# Altium schematic sheet TC264Power.SchDoc
size A1; SheetNumber: 1; SheetTotal: 1
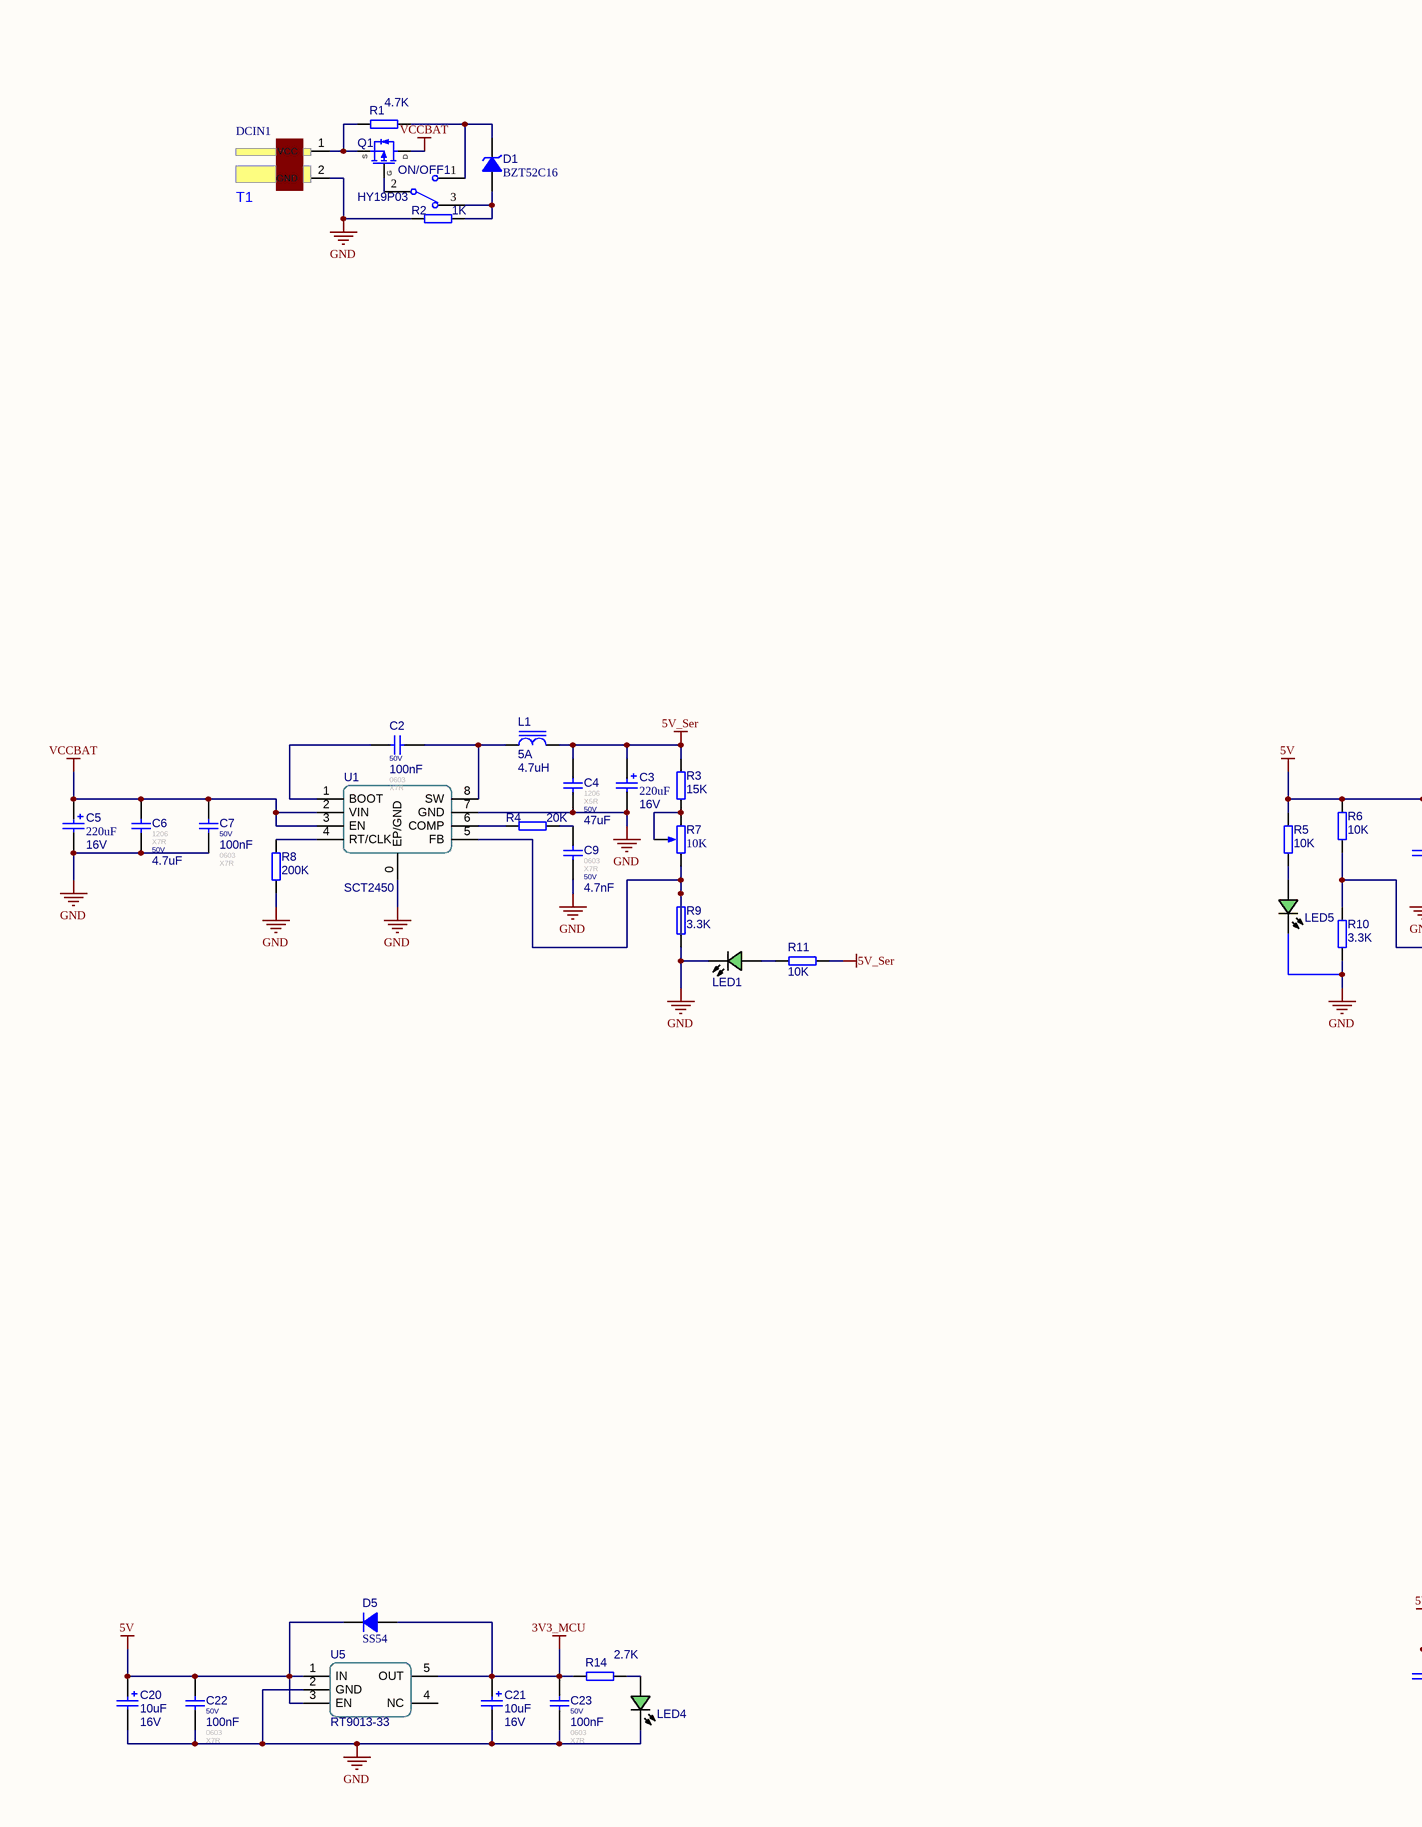
[diagram p0: TC264Power.SchDoc, left]
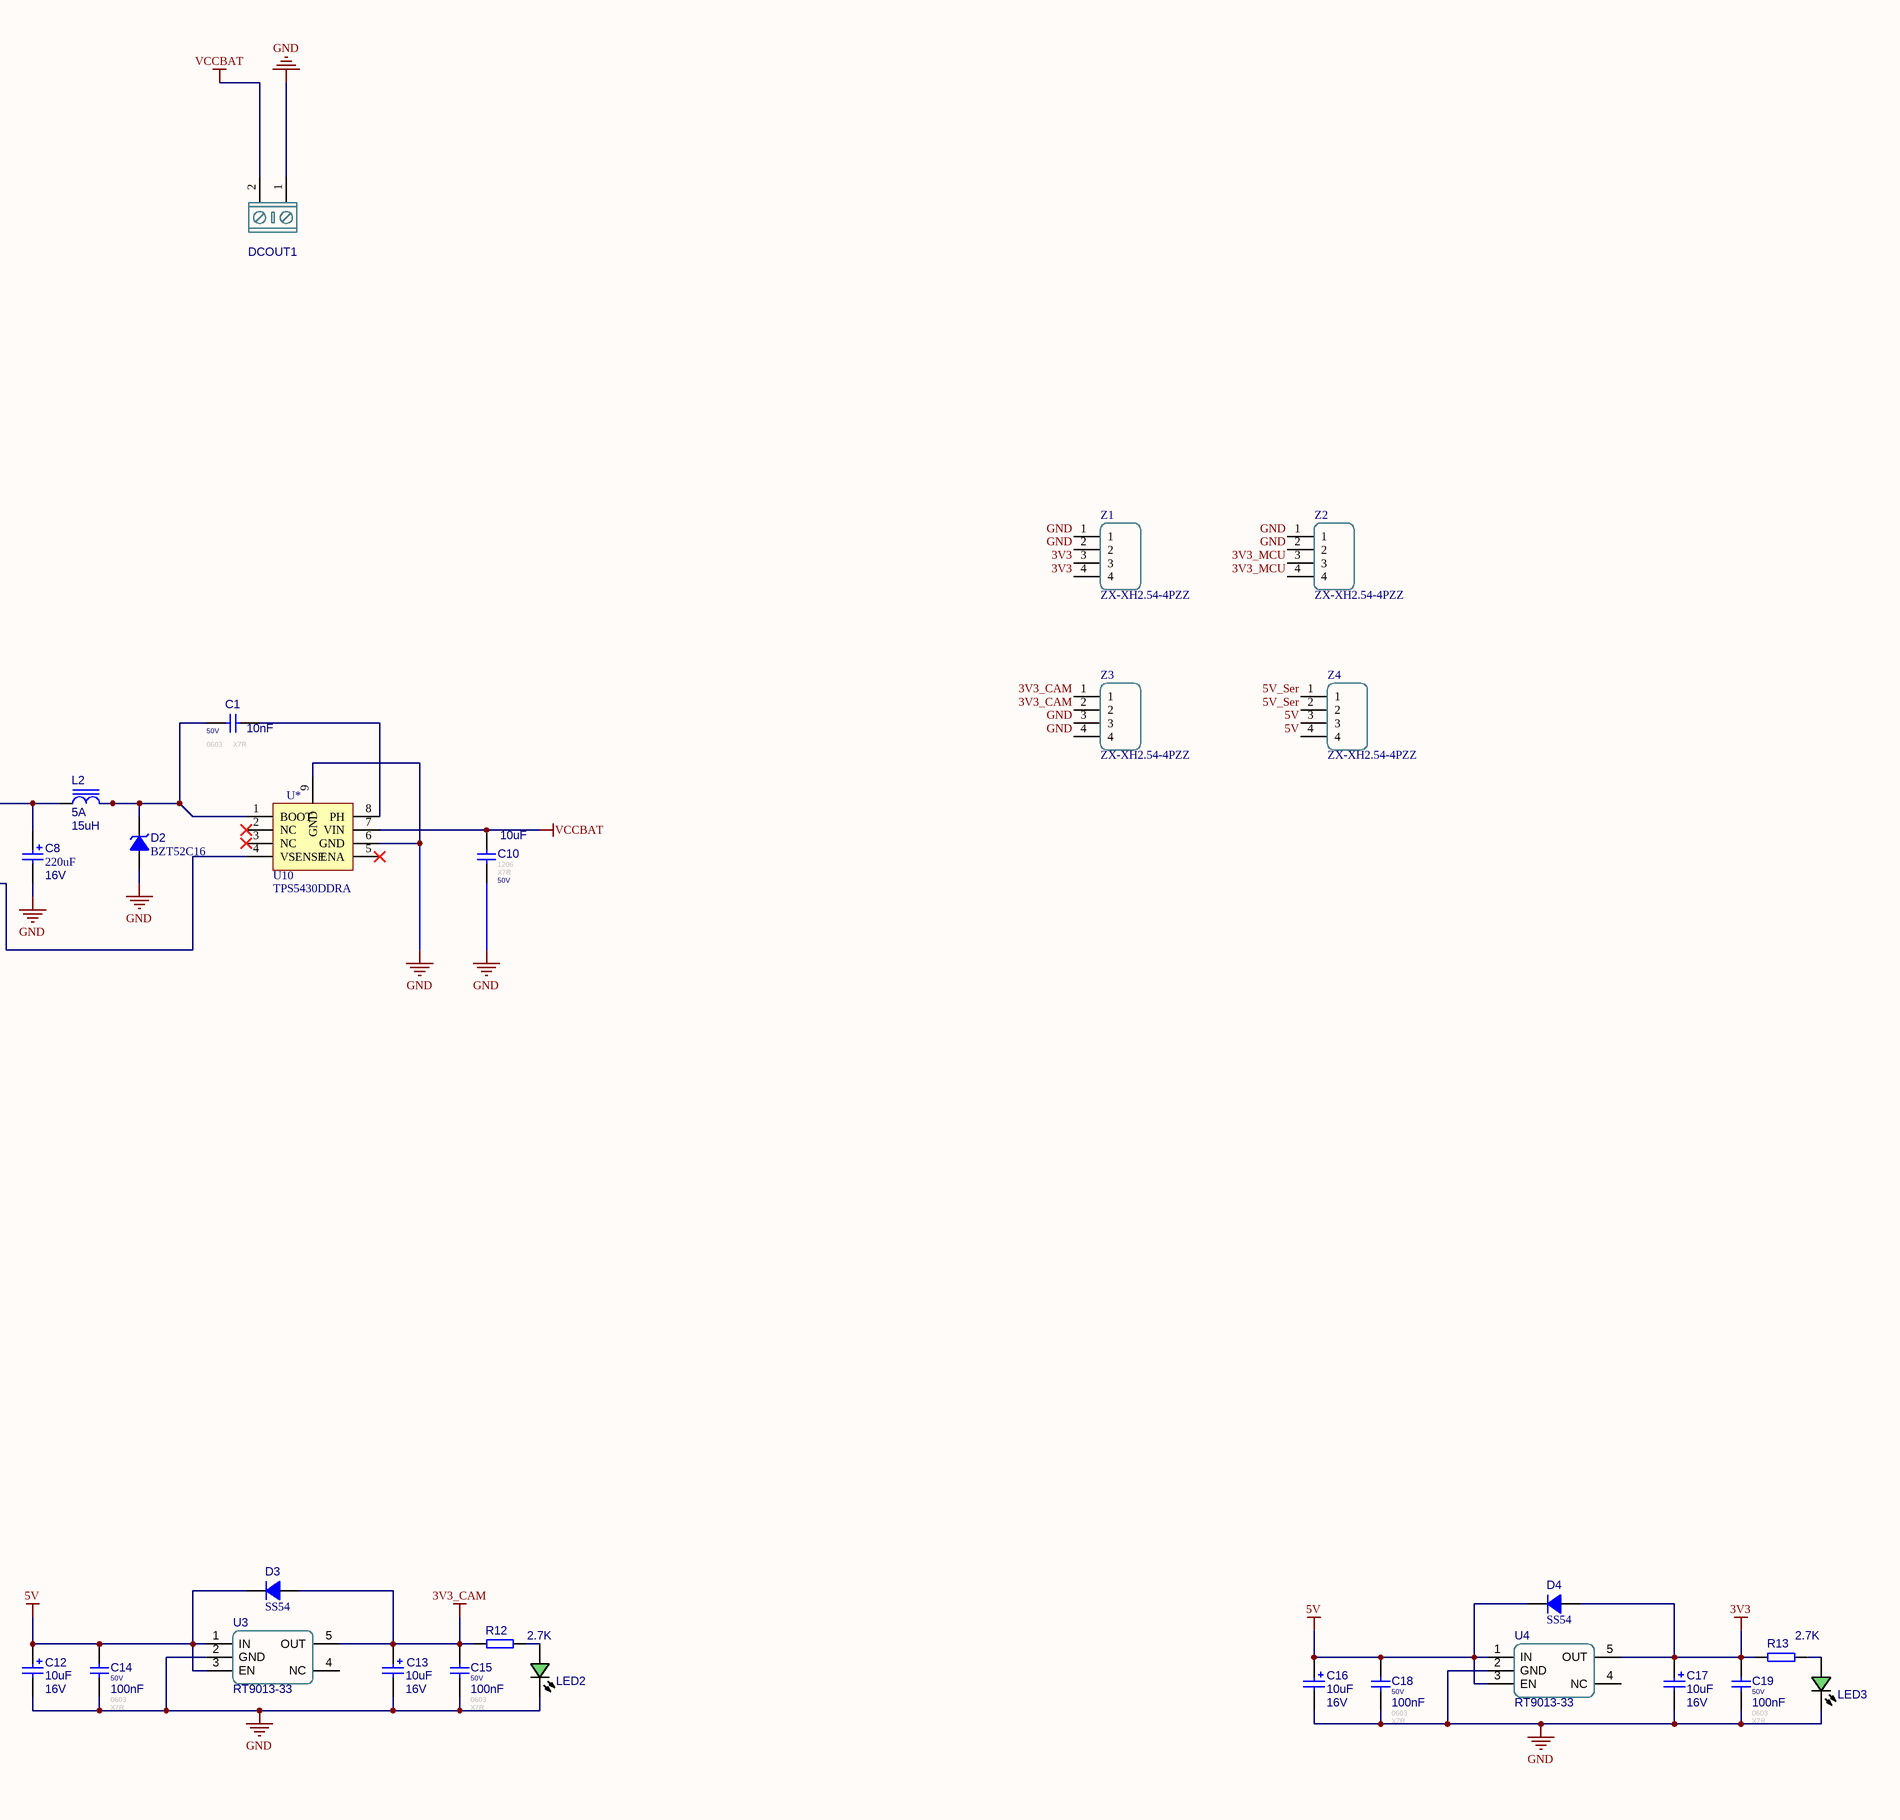
[diagram p1: TC264Power.SchDoc, right]

## Parts
C1  value 10nF  Voltage: 50V  Footprint: 0603  Type: X7R  [CAPC3216[1206]S]  (hidden comment: 10nF ±10% 50V)
C2  value 100nF  Voltage: 50V  Footprint: 0603  Type: X7R  [CAPC3216[1206]S]  (hidden comment: 100nF ±10% 50V)
C3  value 220uF  Voltage: 16V  [CAPS6.3]  (hidden comment: 220uF 16V)
C4  value 47uF  Footprint: 1206  Type: X5R  Voltage: 50V  [CAPC3216[1206]S]  (hidden comment: 47uF ±10% 50V)
C5  value 220uF  Voltage: 16V  [CAPS6.3]  (hidden comment: 220uF 16V)
C6  value 4.7uF  Footprint: 1206  Type: X7R  Voltage: 50V  [CAPC3216[1206]S]  (hidden comment: 4.7uF ±10% 50V)
C7  value 100nF  Voltage: 50V  Footprint: 0603  Type: X7R  [CAPC3216[1206]S]  (hidden comment: 100nF ±10% 50V)
C8  value 220uF  Voltage: 16V  [CAPS6.3]  (hidden comment: 220uF 16V)
C9  value 4.7nF  Footprint: 0603  Type: X7R  Voltage: 50V  [CAPC3216[1206]S]  (hidden comment: 4.7nF ±10% 50V)
C10  value 10uF  Footprint: 1206  Type: X7R  Voltage: 50V  [CAPC3216[1206]S]  (hidden comment: 10uF ±10% 50V)
C12  value 10uF  Voltage: 16V  [CAPT3216]  (hidden comment: 10uF 16V)
C13  value 10uF  Voltage: 16V  [CAPT3216]  (hidden comment: 10uF 16V)
C14  value 100nF  Voltage: 50V  Footprint: 0603  Type: X7R  [CAPC3216[1206]S]  (hidden comment: 100nF ±10% 50V)
C15  value 100nF  Voltage: 50V  Footprint: 0603  Type: X7R  [CAPC3216[1206]S]  (hidden comment: 100nF ±10% 50V)
C16  value 10uF  Voltage: 16V  [CAPT3216]  (hidden comment: 10uF 16V)
C17  value 10uF  Voltage: 16V  [CAPT3216]  (hidden comment: 10uF 16V)
C18  value 100nF  Voltage: 50V  Footprint: 0603  Type: X7R  [CAPC3216[1206]S]  (hidden comment: 100nF ±10% 50V)
C19  value 100nF  Voltage: 50V  Footprint: 0603  Type: X7R  [CAPC3216[1206]S]  (hidden comment: 100nF ±10% 50V)
C20  value 10uF  Voltage: 16V  [CAPT3216]  (hidden comment: 10uF 16V)
C21  value 10uF  Voltage: 16V  [CAPT3216]  (hidden comment: 10uF 16V)
C22  value 100nF  Voltage: 50V  Footprint: 0603  Type: X7R  [CAPC3216[1206]S]  (hidden comment: 100nF ±10% 50V)
C23  value 100nF  Voltage: 50V  Footprint: 0603  Type: X7R  [CAPC3216[1206]S]  (hidden comment: 100nF ±10% 50V)
D1  BZT52C16  [SOD-123-L]
D2  BZT52C16  [SOD-123-L]
D3  SS54  [SMA[DO-214AC]]
D4  SS54  [SMA[DO-214AC]]
D5  SS54  [SMA[DO-214AC]]
DCIN1  T1  [Wired T-Header ThroughHole]
DCOUT1  KF/WJ/DG 30x connecter  [KF/WJ/DG 301-2p-5.0mm]  (value not drawn)
L1  value 4.7uH  Imax: 5A  [0630 TPC 7*7*3]  (hidden comment: 4.7uH 5A)
L2  value 15uH  Imax: 5A  [0630 TPC 7*7*3]  (hidden comment: 15uH 5A)
LED1  翠绿贴片LED  [LEDC1608(0603)]  (value not drawn)
LED2  翠绿贴片LED  [LEDC1608(0603)]  (value not drawn)
LED3  翠绿贴片LED  [LEDC1608(0603)]  (value not drawn)
LED4  翠绿贴片LED  [LEDC1608(0603)]  (value not drawn)
LED5  翠绿贴片LED  [LEDC1608(0603)]  (value not drawn)
ON/OFF1  SW-SPDT  [SS12D10]  (value not drawn)
Q1  HY19P03  [TO-252AA]
R1  value 4.7K  [RESC1608[0603]S-N]  (hidden comment: 4.7K ±1%)
R2  value 1K  [RESC1608[0603]S-N]  (hidden comment: 1K ±1%)
R3  value 15K  [RESC1608[0603]S-N]  (hidden comment: 15K ±1%)
R4  value 20K  [RESC1608[0603]S-N]  (hidden comment: 20K ±1%)
R5  value 10K  [RESC1608[0603]S-N]  (hidden comment: 10K ±1%)
R6  value 10K  [RESC1608[0603]S-N]  (hidden comment: 10K ±1%)
R7  10K  [RESPOT3296]
R8  value 200K  [RESC1608[0603]S-N]  (hidden comment: 200K ±1%)
R9  value 3.3K  [RESC1608[0603]S-N]  (hidden comment: 3.3K ±1%)
R10  value 3.3K  [RESC1608[0603]S-N]  (hidden comment: 3.3K ±1%)
R11  value 10K  [RESC1608[0603]S-N]  (hidden comment: 10K ±1%)
R12  value 2.7K  [RESC1608[0603]S-N]  (hidden comment: 2.7K ±1%)
R13  value 2.7K  [RESC1608[0603]S-N]  (hidden comment: 2.7K ±1%)
R14  value 2.7K  [RESC1608[0603]S-N]  (hidden comment: 2.7K ±1%)
U1  SCT2450  [SOP-8E]
U3  RT9013-33  [SOT-23-5]
U4  RT9013-33  [SOT-23-5]
U5  RT9013-33  [SOT-23-5]
U10  TPS5430DDRA  [SOP8-1R27-3R90]
Z1  ZX-XH2.54-4PZZ  [ZX-XH2.54-4PZZ]
Z2  ZX-XH2.54-4PZZ  [ZX-XH2.54-4PZZ]
Z3  ZX-XH2.54-4PZZ  [ZX-XH2.54-4PZZ]
Z4  ZX-XH2.54-4PZZ  [ZX-XH2.54-4PZZ]

## Nets
3V3: C17.1 C19.2 D4.A R13.1 U4.5(OUT) Z1.3 Z1.4
3V3_CAM: C13.1 C15.2 D3.A R12.1 U3.5(OUT) Z3.1 Z3.2
3V3_MCU: C21.1 C23.2 D5.A R14.1 U5.5(OUT) Z2.3 Z2.4
5V: C8.1 C12.1 C14.2 C16.1 C18.2 C20.1 C22.2 D3.K D4.K D5.K L2.1 R5.2 R6.2 U3.1(IN) U3.3(EN) U4.1(IN) U4.3(EN) U5.1(IN) U5.3(EN) Z4.3 Z4.4
5V_Ser: C3.1 C4.2 L1.2 R3.2 R11.2 Z4.1 Z4.2
GND: C3.2 C4.1 C5.2 C6.1 C7.1 C8.2 C9.2 C10.2 C12.2 C13.2 C14.1 C15.1 C16.2 C17.2 C18.1 C19.1 C20.2 C21.2 C22.1 C23.1 D2.A DCIN1.2(GND) DCOUT1.1 LED1.C LED2.C LED3.C LED4.C LED5.C R2.2 R8.1 R9.2 R10.2 U1.0(EP/GND) U1.7(GND) U3.2(GND) U4.2(GND) U5.2(GND) U10.6(GND) U10.9(GND) Z1.1 Z1.2 Z2.1 Z2.2 Z3.3 Z3.4
VCCBAT: C5.1 C6.2 C7.2 C10.1 DCOUT1.2 Q1.1(D) U1.2(VIN) U1.3(EN) U10.7(VIN)
NetC1_1: C1.1 D2.K L2.2 U10.1(BOOT)
NetC1_2: C1.2 U10.8(PH)
NetC2_1: C2.1 U1.1(BOOT)
NetC2_2: C2.2 L1.1 U1.8(SW)
NetC9_1: C9.1 R4.1
NetD1_A: D1.A ON/OFF1.3 R2.1
NetD1_K: D1.K ON/OFF1.1 R1.2
NetDCIN1_1: DCIN1.1(VCC) Q1.3(S) R1.1
NetLED1_A: LED1.A R11.1
NetLED2_A: LED2.A R12.2
NetLED3_A: LED3.A R13.2
NetLED4_A: LED4.A R14.2
NetLED5_A: LED5.A R5.1
NetON/OFF1_2: ON/OFF1.2 Q1.2(G)
NetR3_1: R3.1 R7.1(TOP) R7.ADJ
NetR4_2: R4.2 U1.6(COMP)
NetR6_1: R6.1 R10.1 U10.4(VSENSE)
NetR7_2: R7.2(BOT) R9.1 U1.5(FB)
NetR8_2: R8.2 U1.4(RT/CLK)

Not connected (* = marked no-connect by the designer): U3 4(NC); U4 4(NC); U5 4(NC); U10 2(NC)* 3(NC)* 5(ENA)*

## Notes on the sheet
- (in symbol TPS5430DDRA) U*

## Library data of the parts
C1 C2 C7 C14 C15 C18 C19 C22 C23 = Cap-Chip: 贴片电容; Published: 2021-12-13; Revision: V1.2; Tolerance: ±10%
C3 C5 C8 = Cap-Solid_1: Polarized Capacitor (Radial); Published: 8-Jun-2000; Revision: July-2002: Re-released for DXP Platform.; Publisher: Altium Limited; Price(RMB): 0.000
C4 = Cap-Chip_2: 贴片电容; Published: 2021-12-13; Revision: V1.2; Tolerance: ±10%
C6 C10 = Cap-Chip_1: 贴片电容; Published: 2021-12-13; Revision: V1.2; Tolerance: ±10%
C9 = Cap-Chip_3: 贴片电容; Published: 2021-12-13; Revision: V1.2; Tolerance: ±10%
C12 C13 C16 C17 C20 C21 = Cap-Tan: Tantalum Capacitor; Published: 8-Jun-2000; Revision: July-2002: Re-released for DXP Platform.; Publisher: Altium Limited; Price(RMB): 0.000
D1 D2 = Diode TVS Uni-Dir: TRANSIENT VOLTAGE  SUPPRESSOR DIODE; Imax: 500mA; Published: 8-Jun-2000; Publisher: Altium Limited; Price(RMB): 0.000
D3-D5 = Diode: 普通二极管 Diode; Imax: 500mA; Published: 8-Jun-2000; Revision: July-2002: Re-released for DXP Platform.; Publisher: Altium Limited; Price(RMB): 0.000
DCIN1 = T_Header: T型插头
DCOUT1 = KF/WJ/DG 30x: 接线端子 2Pin
L1 L2 = Ind-Power: 功率电感; DCR: .5m; Published: 8-Jun-2000; Revision: July-2002: Re-released for DXP Platform.; Publisher: Altium Limited; Price(RMB): 0.000
LED1-LED5 = LED Chip Green: Published: 8-Jun-2000; Revision: July-2002: Re-released for DXP Platform.; Publisher: Altium Limited; Price(RMB): 0.00
ON/OFF1 = SW-SPDT: 单刀双掷开关 3脚船型、钮子、拨动开关 SPDT Subminiature Toggle Switch; Published: 24-Mar-1999; Publisher: Altium Limited; Price(RMB): 0.000
Q1 = HY19P03: HY19P03 P-Channel MOSFET
R1 = Res-Chip_4: 贴片电阻; Published: 8-Jun-2000; Revision: July-2002: Re-released for DXP Platform.; Tolerance: ±1%
R2 = Res-Chip_3: 贴片电阻; Published: 8-Jun-2000; Revision: July-2002: Re-released for DXP Platform.; Tolerance: ±1%
R3 = Res-Chip_7: 贴片电阻; Published: 8-Jun-2000; Revision: July-2002: Re-released for DXP Platform.; Tolerance: ±1%
R4 = Res-Chip_6: 贴片电阻; Published: 8-Jun-2000; Revision: July-2002: Re-released for DXP Platform.; Tolerance: ±1%
R5 R6 R11 = Res-Chip: 贴片电阻; Published: 8-Jun-2000; Revision: July-2002: Re-released for DXP Platform.; Tolerance: ±1%
R7 = Res-Adj-3p: 可调电阻; Value: 10K
R8 = Res-Chip_5: 贴片电阻; Published: 8-Jun-2000; Revision: July-2002: Re-released for DXP Platform.; Tolerance: ±1%
R9 R10 = Res-Chip_8: 贴片电阻; Published: 8-Jun-2000; Revision: July-2002: Re-released for DXP Platform.; Tolerance: ±1%
R12-R14 = Res-Chip_2: 贴片电阻; Published: 8-Jun-2000; Revision: July-2002: Re-released for DXP Platform.; Tolerance: ±1%
U1 = SCT2450: 3.8V-36V Vin, 5A, High Efficiency Synchronous Step-down DCDC Converter / with Programmable Frequency
U3-U5 = RT9013-33: 3.3V 500mA SOT-23-5 LDO
Z1-Z4 = ZX-XH2.54-4PZZ: 接线端子